# EAGLE design rx_sensor (EAGLE 7.2.0)
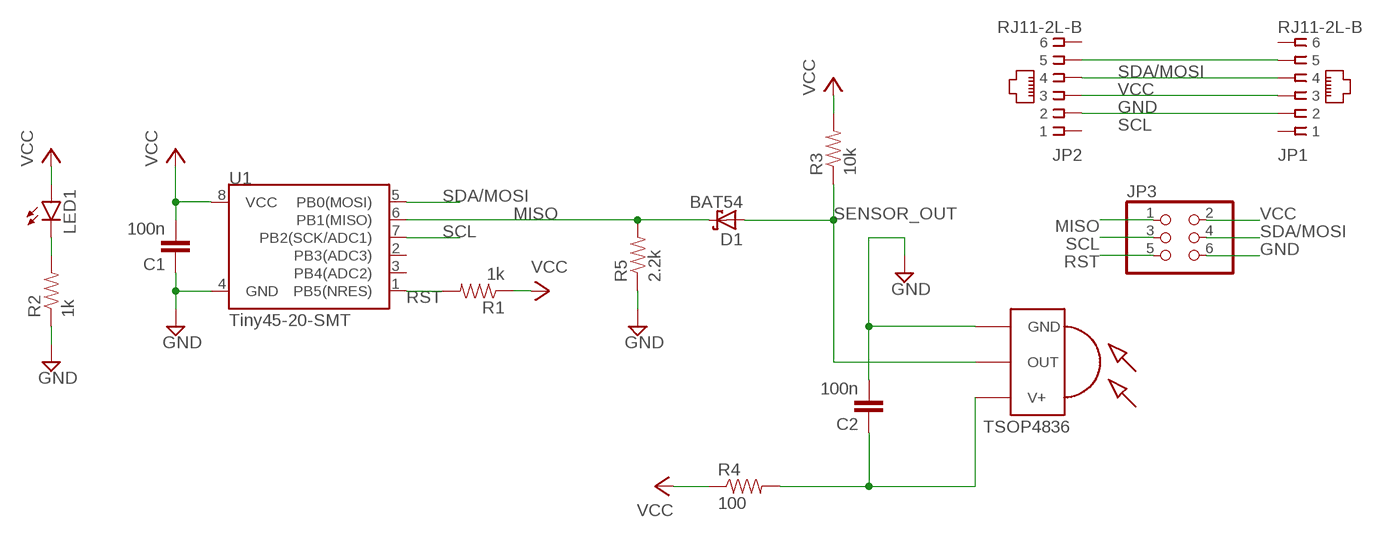
[diagram p0: schematic, sheet 1]

## Parts
C1  100n  CAP0603-CAP  [0603-CAP]
C2  100n  CAP0603-CAP  [0603-CAP]
D1  BAT54  [SOT23]
JP1  RJ11-2L-B  [RJ11-NO_SHIELD]
JP2  RJ11-2L-B  [RJ11-NO_SHIELD]
JP3  PINHD-2X3  [2X03]
LED1  LED0603  [LED-0603]
R1  1k  RESISTOR0603  [0603-RES]
R2  1k  RESISTOR0603  [0603-RES]
R3  10k  RESISTOR0603  [0603-RES]
R4  100  RESISTOR0603  [0603-RES]
R5  2.2k  RESISTOR0603  [0603-RES]
TSOP4836  TSOP4836  [TSOP18XX]
U1  Tiny45-20-SMT  ATTINY45TINY45-20-SMT  [SO08-EIAJ]

## Nets
GND: C1.1 C2.2 JP1.3 JP2.3 JP3.6 R2.1 R5.1 TSOP4836.GND U1.4(GND)
MISO: D1.3(C) JP3.1 R5.2 U1.6(PB1(MISO))
N$1: LED1.C R2.2
N$2: C2.1 R4.2 TSOP4836.VCC(V+)
RST: JP3.5 R1.2 U1.1(PB5(NRES))
SCL: JP1.2 JP2.2 JP3.3 U1.7(PB2(SCK/ADC1))
SDA/MOSI: JP1.5 JP2.5 JP3.4 U1.5(PB0(MOSI))
SENSOR_OUT: D1.1(A) R3.1 TSOP4836.OUT
VCC: C1.2 JP1.4 JP2.4 JP3.2 LED1.A R1.1 R3.2 R4.1 U1.8(VCC)
Unconnected: JP1.1 JP1.6 JP2.1 JP2.6 U1.2(PB3(ADC3)) U1.3(PB4(ADC2))

## Library data of the parts
C1 C2 = SparkFun-Capacitors:CAP: Capacitor Standard 0603 ceramic capacitor, and 0.1" leaded capacitor.
D1 = diode:BAT54: Schottky Diodes Source: Fairchild .. BAT54.pdf
JP1 JP2 = con-tycoelectronics:RJ11: CORCOM Modular RJ Jacks No Shield Source: www.tycoelectronics.com .. ENG_DS_1654001_1099_RJ_L_0507.pdf; MF: TYCO ELECTRONICS; MPN: RJ11-2L-B; OC_FARNELL: unknown; OC_NEWARK: 83F4463
JP3 = pinhead:PINHD-2X3: PIN HEADER
LED1 = SparkFun-LED:LED: LEDs Standard schematic elements and footprints for 5mm, 3mm, 1206, and 0603 sized LEDs. 5mm - Spark Fun Electronics SKU : COM-00529 (and others)
R1-R5 = SparkFun-Resistors:RESISTOR: Resistor Basic schematic elements and footprints for 0603, 1206, and PTH resistors.
TSOP4836 = tsop-1:TSOP4836: IR Receiver and Demodulator
U1 = SparkFun-DigitalIC:ATTINY45: Atmel 8-pin 2/4/8kB flash uC; PROD_ID: IC-08922

## Board
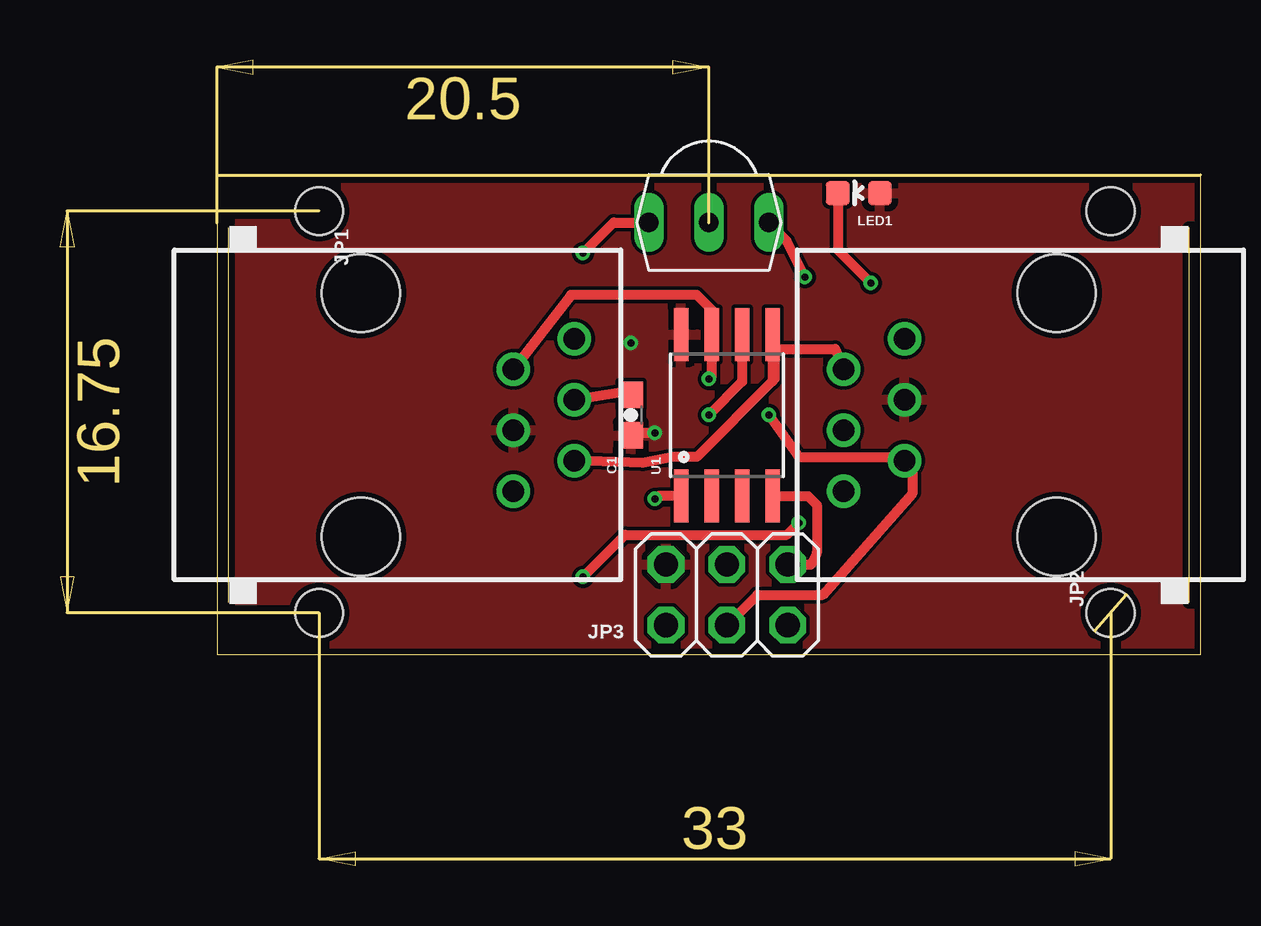
[diagram p1: board, top side]
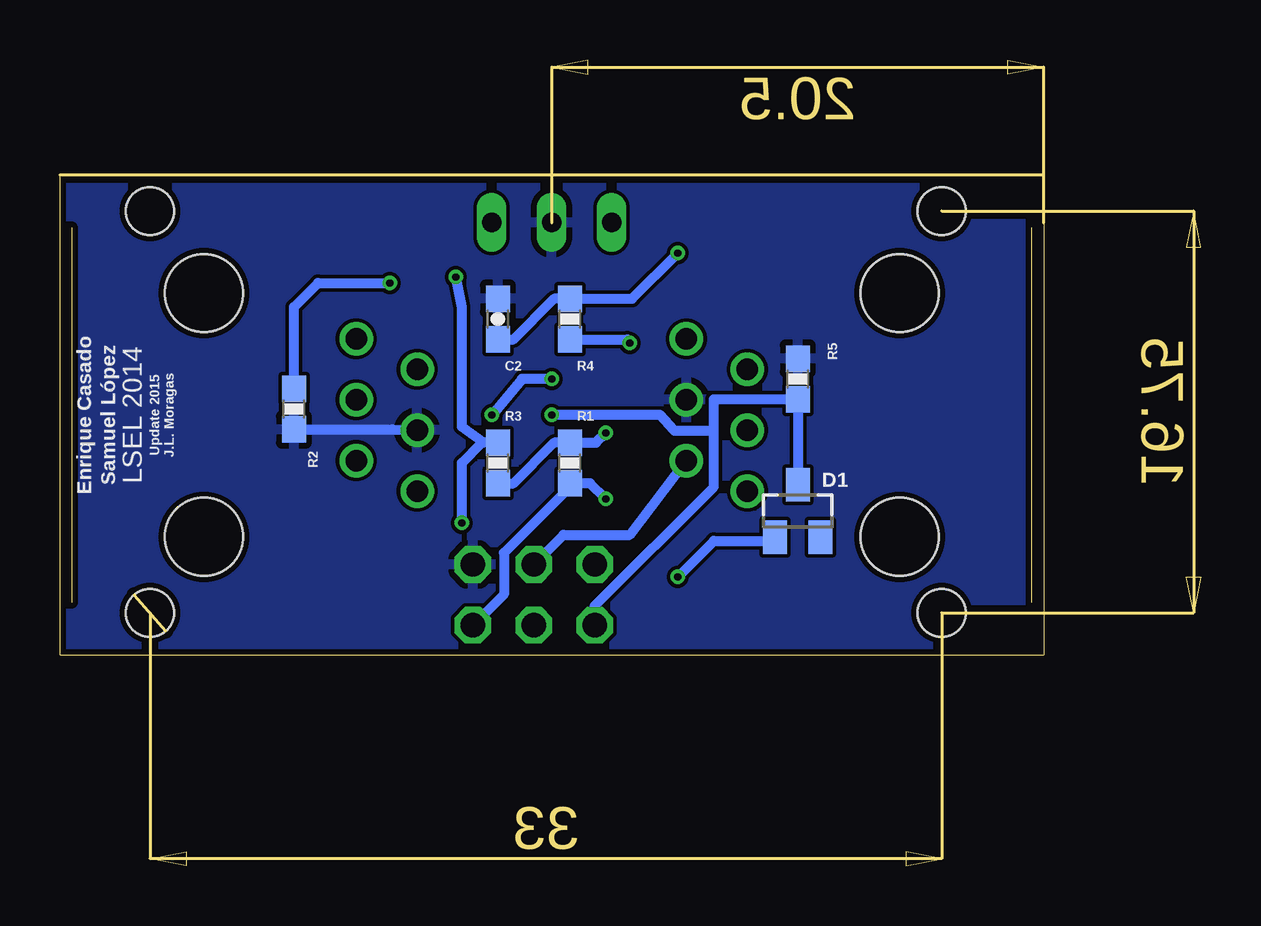
[diagram p2: board, bottom side, seen from below]

Size 41 x 20 mm. Coordinates in mm from the lower left corner, seen from the top.
Outline: 41,0 41,20 0,20 0,0 41,0
Copper layers (1*2*15*16): Top 0.035mm / dielectric 0.2mm / layer 2 0.0175mm / dielectric 1.1mm / layer 15 0.0175mm / dielectric 0.2mm / Bottom 0.035mm
Design rules "SeeedStudio_DRU_no_angle_20130527": minimum track width 6mil, minimum drill 12mil, track to track 6mil, track to pad 6mil, pad to pad 6mil, via to via 6mil, smd to smd 0mil, copper to edge 10mil, drill to drill 10mil, minimum pad ring 6mil, minimum via ring 6mil, stop-mask expansion 2mil, vias tented up to drill 25mil, thermal gap 10mil
Holes 2 mm at 4.25,18.5 4.25,1.75 37.25,1.75 37.25,18.5

### Footprints (pad centres in the part's own frame; a part is rotated, then mirrored left to right if it is on the bottom)
0603-CAP = smd 1.1 x 1: 1 -0.85,0; 2 0.85,0
SOT23 = smd 1 x 1.4: 1 -0.95,-1.1; 2 0.95,-1.1; 3 0,1.1
RJ11-NO_SHIELD = drill 0.9 pad 1.4: 1 -3.175,8.89; 2 -1.905,6.35; 3 -0.635,8.89; 4 0.635,6.35; 5 1.905,8.89; 6 3.175,6.35 | hole 3.251: -5.08,0; 5.08,0
2X03 = drill 1.016 octagon: 1 -2.54,-1.27; 2 -2.54,1.27; 3 0,-1.27; 4 0,1.27; 5 2.54,-1.27; 6 2.54,1.27
LED-0603 = smd 1 x 1: A 0,-0.877; C 0,0.877
0603-RES = smd 1.1 x 1: 1 -0.85,0; 2 0.85,0
TSOP18XX = drill 0.813 long: GND -0.001,-0.027; OUT -2.501,-0.027; VCC 2.499,-0.027
SO08-EIAJ = smd 0.61 x 2.21: 1 -1.905,-3.378; 2 -0.635,-3.378; 3 0.635,-3.378; 4 1.905,-3.378; 5 1.905,3.353; 6 0.635,3.353; 7 -0.635,3.353; 8 -1.905,3.353

### Placement (x,y rotation side)
C1  17.25,10 270 top
C2  22.75,14 90 bottom
D1  10.25,6 0 bottom
JP1  6,10 270 top
JP2  35,10 90 top
JP3  21.25,2.5 0 top
LED1  26.75,19.25 90 top
R1  19.75,8 270 bottom
R2  31.25,10.25 90 bottom
R3  22.75,8 270 bottom
R4  19.75,14 90 bottom
R5  10.25,11.5 270 bottom
TSOP4836  20.5,18 180 top
U1  21.25,10 0 top

### Tracks (layer width: path | path; a pad name or v marks a point on that pad's centre or on a via)
GND
  Top 0.406: JP1.3 17.1,11 C1.1 | JP3.6 23.81,3.75 24.75,3.75 25,4.25 25,6.25 24.63,6.62 U1.4
  Bottom 0.406: R2.1 27.15,9.4 JP2.3
  pour Bottom: 0,0 41,0 41,20 0,20
MISO  (via drill 0.3)
  Top 0.406: U1.6 21.88,11.38 v20.5,10
  Bottom 0.406: D1.3 R5.2 13.75,10.65 13.75,9.25 | JP3.1 18.71,2.04 13.75,7 13.75,9.25 | v20.5,10 16,10 15.4,9.35 13.85,9.35 13.75,9.25
N$1  (via drill 0.3)
  Top 0.406: LED1.C 25.87,16.88 v27.25,15.5
  Bottom 0.406: R2.2 31.25,14.5 30.25,15.5 v27.25,15.5
N$2  (via drill 0.3)
  Top 0.406: v15.25,16.75 16.53,18.03 TSOP4836.VCC
  Bottom 0.406: v15.25,16.75 17.15,14.85 R4.2 20.4,14.85 22.1,13.15 C2.1
RST  (via drill 0.3)
  Top 0.406: U1.1 18.37,6.62 v18.25,6.5
  Bottom 0.406: JP3.5 22.5,2.52 22.5,4.25 19.75,7 R1.2 18.9,7.15 v18.25,6.5
SCL  (via drill 0.3)
  Top 0.406: v23,10 24.25,8.25 28.55,8.25 | JP3.3 22.52,2.5 25.25,2.5 29,6.75 29,8.3 28.55,8.25 | v20.5,11.5 20.62,11.62 U1.7 20.62,14.39 20,15 14.75,15 JP1.2 | 28.55,8.25 JP2.2
  Bottom 0.406: v20.5,11.5 21.75,11.5 v23,10
SDA/MOSI
  Top 0.406: JP1.5 17.75,8 19,8.25 20,8.25 23.16,11.4 U1.5 23.25,13.35 23.25,12.75 | 23.25,11.5 23.25,12.75 | 23.25,12.75 25.77,12.75 JP2.5
  Bottom 0.406: JP3.4 20.02,5 17.25,5 JP1.5
SENSOR_OUT  (via drill 0.3)
  Top 0.406: v15.25,3.25 17,5 23.75,5 v24.25,5.5 | v24.5,15.75 23.75,17.25 TSOP4836.OUT
  Bottom 0.406: v24.5,15.75 24.25,14.5 24.25,9.5 23.35,8.85 | v24.25,5.5 24.25,8 23.4,8.85 23.35,8.85 | R3.1 23.35,8.85 | v15.25,3.25 13.75,4.75 11.35,4.75 D1.1
VCC  (via drill 0.3)
  Top 0.406: v18.25,9.25 17.35,9.25 C1.2
  Bottom 0.406: R4.1 17.35,13.15 v17.25,13 | v18.25,9.25 18.65,8.85 R1.1 20.4,8.85 22.1,7.15 R3.2
  pour Top: 0,20 41,20 41,0 0,0

### Text on the board
bPlace: Update 2015 / J.L. Moragas | LSEL 2014 | Samuel López | Enrique Casado